# Altium project audiometr.PrjPcb
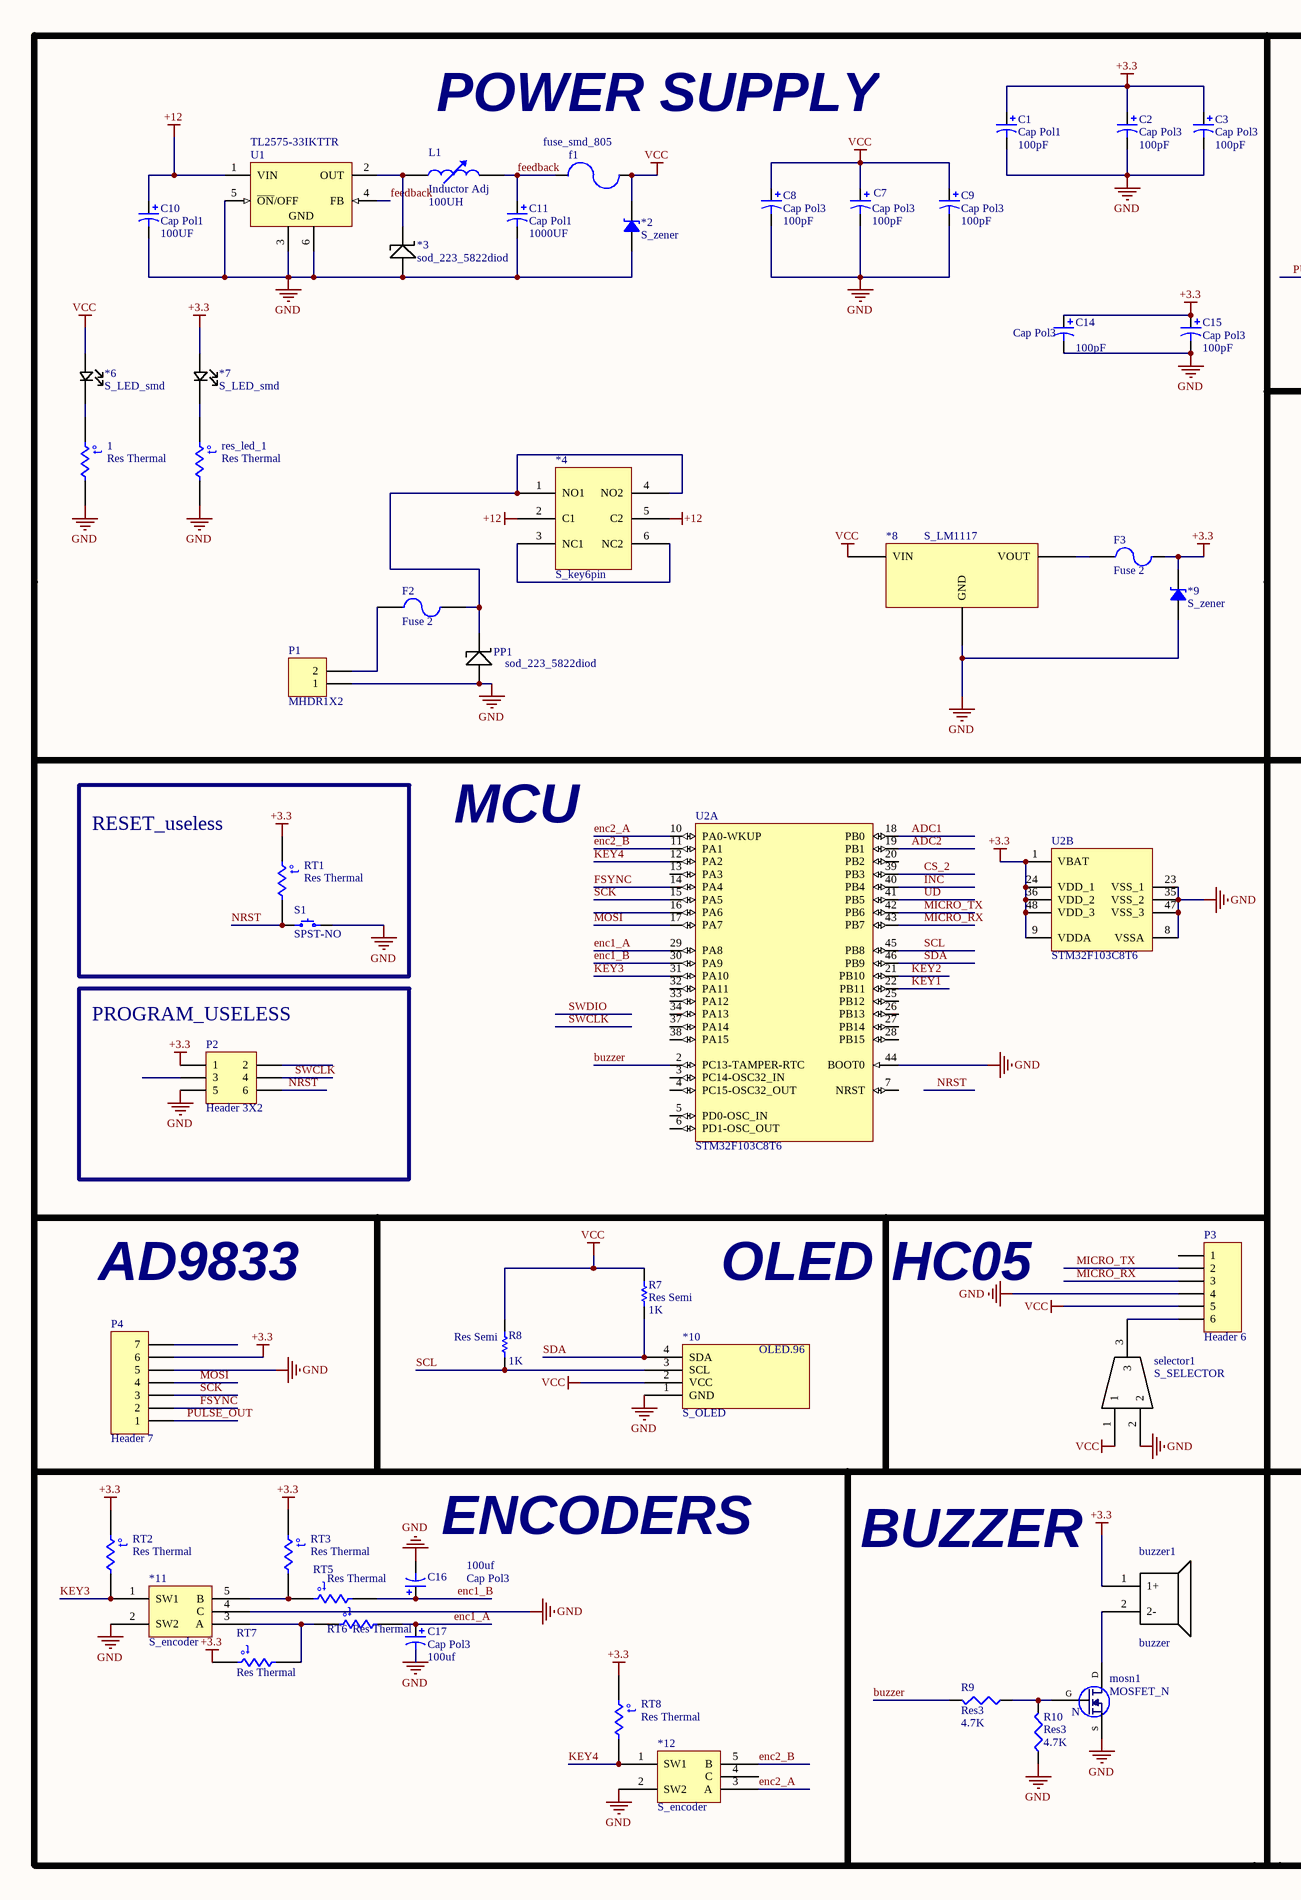
[diagram p0: audiometer.SchDoc, left]
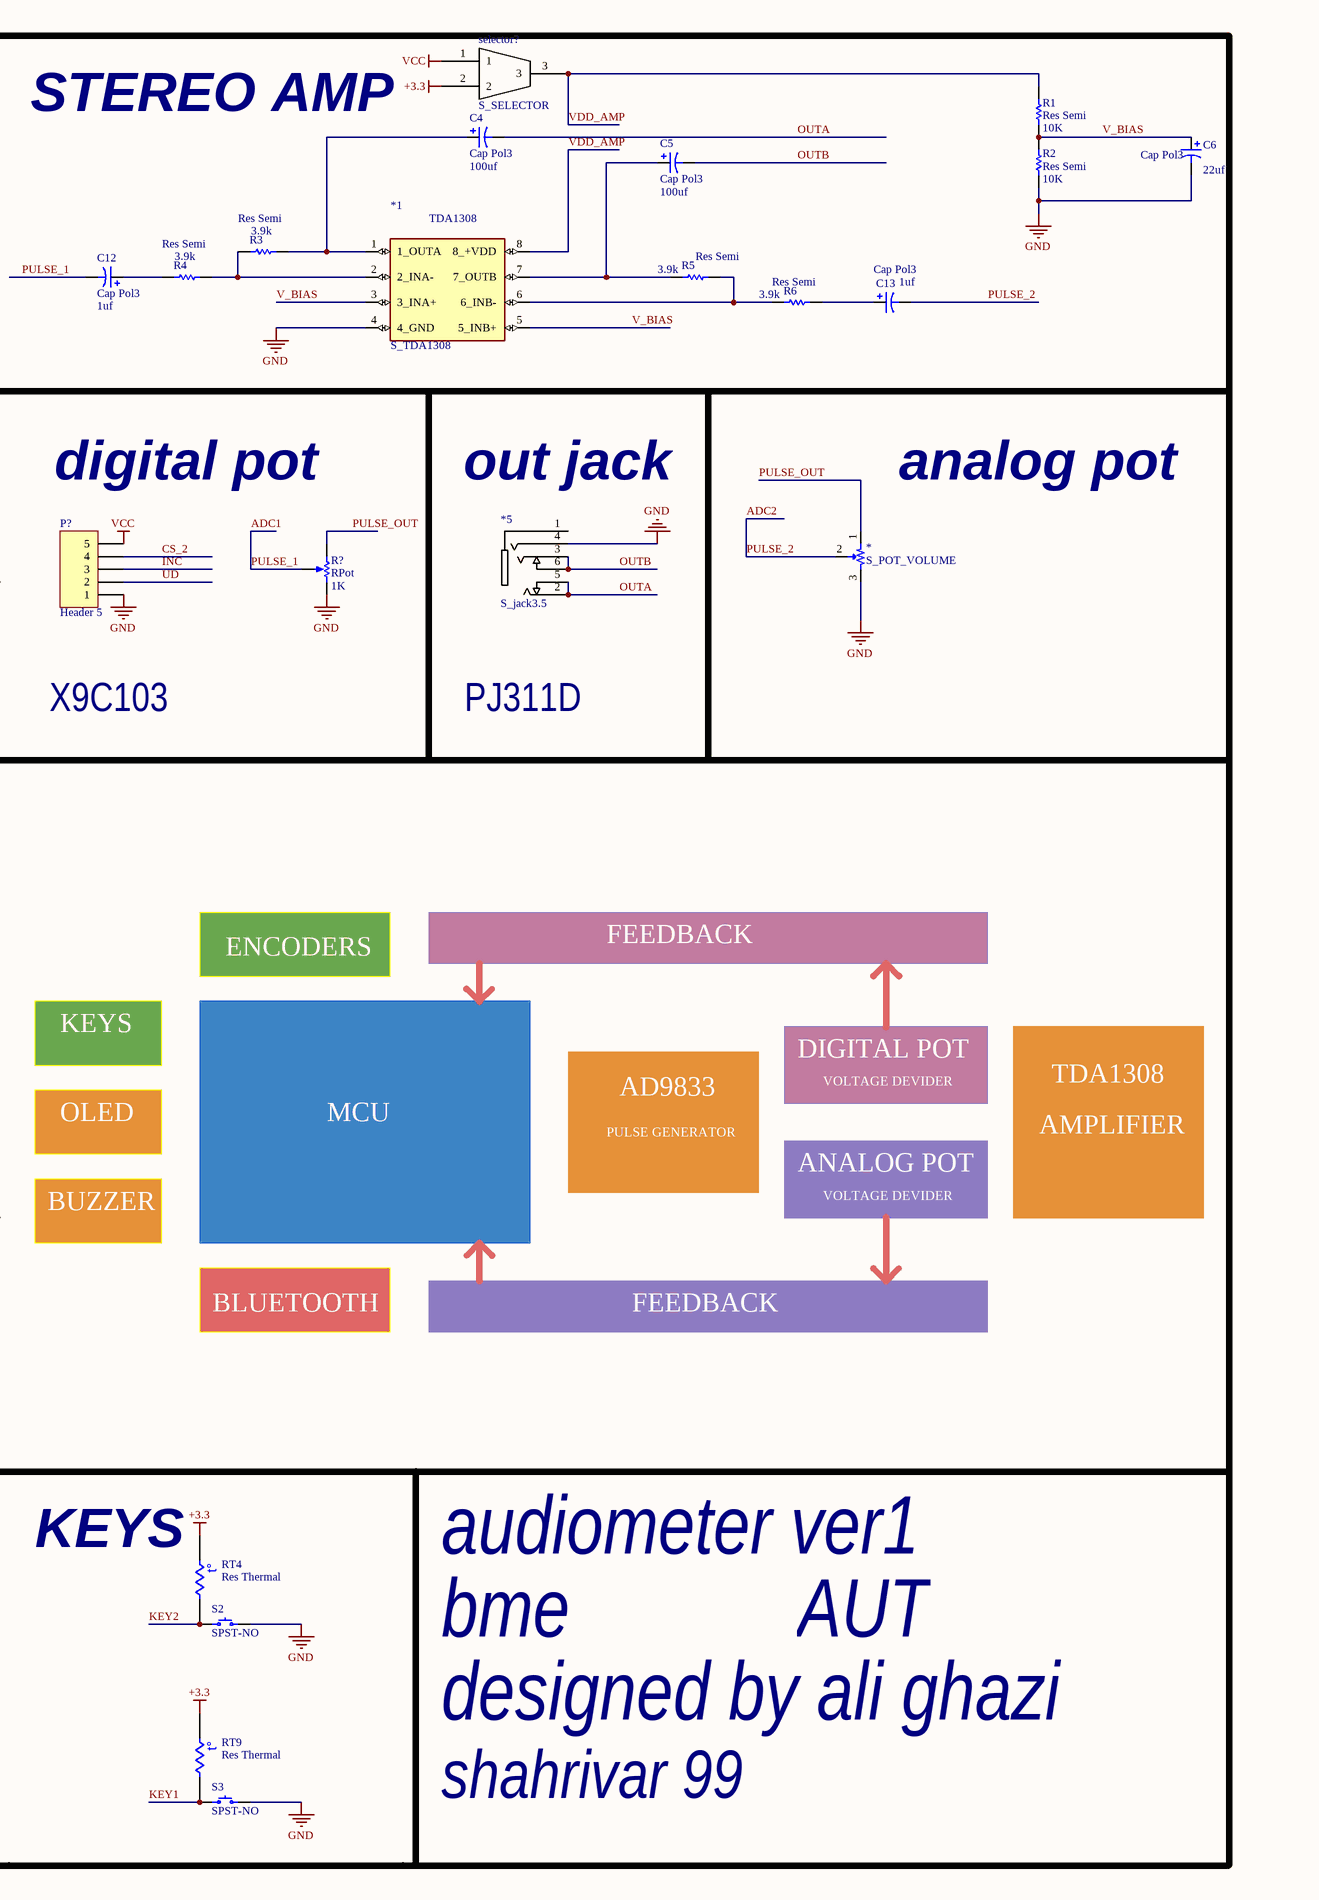
[diagram p1: audiometer.SchDoc, right]
1 sheet, 71 parts. Net scope: global (net labels, ports and power ports of the same name join across sheets).
Board file: audiometer.PcbDoc

## Sheet audiometer.SchDoc
size C

### Parts
1  Res Thermal  [6-0805_N]
*  S_POT_VOLUME  [F_POT_VOLUME]
*1  S_TDA1308  [F_TDA1308_so8]
*2  S_zener  [F_SMD_ZENR]
*3  sod_223_5822diod  [sod223-diod-5822]
*4  S_key6pin  [F_key6pin]
*5  S_jack3.5  [F_JACK3.5]
*6  S_LED_smd  [F_LED_805]
*7  S_LED_smd  [F_LED_805]
*8  S_LM1117  [F_LM1117]
*9  S_zener  [F_SMD_ZENR]
*10  S_OLED  [F_OLED]
*11  S_encoder  [F_encoder]
*12  S_encoder  [F_encoder]
buzzer1  buzzer  [buzzer]
C1  Cap Pol1  value 100pF  [cap2]
C2  Cap Pol3  value 100pF  [C0805]
C3  Cap Pol3  value 100pF  [C0805]
C4  Cap Pol3  value 100uf  [C0805]
C5  Cap Pol3  value 100uf  [C0805]
C6  Cap Pol3  value 22uf  [C0805]
C7  Cap Pol3  value 100pF  [C0805]
C8  Cap Pol3  value 100pF  [C0805]
C9  Cap Pol3  value 100pF  [C0805]
C10  Cap Pol1  value 100UF  [cap2]
C11  Cap Pol1  value 1000UF  [cap1]
C12  Cap Pol3  value 1uf  [C0805]
C13  Cap Pol3  value 1uf  [C0805]
C14  Cap Pol3  value 100pF  [C0805]
C15  Cap Pol3  value 100pF  [C0805]
C16  Cap Pol3  value 100uf  [C0805]
C17  Cap Pol3  value 100uf  [C0805]
f1  fuse_smd_805  [fuse_smd_805]
F2  Fuse 2  [PIN-W2/E2.8]
F3  Fuse 2  [PIN-W2/E2.8]
L1  Inductor Adj  value 100UH  [12_12_INDUCTOR_SMD]
mosn1  MOSFET_N  [mosfet_n_sot23a]
P1  MHDR1X2  [JST XH B2B-XH-A]
P2  Header 3X2  [HDR2X3]
P3  Header 6  [HDR1X6]
P4  Header 7  [HDR1X7]
P?  Header 5  [HDR1X5]
PP1  sod_223_5822diod  [sod223-diod-5822]
R1  Res Semi  value 10K  [AXIAL-0.5]
R2  Res Semi  value 10K  [AXIAL-0.5]
R3  Res Semi  value 3.9k  [AXIAL-0.5]
R4  Res Semi  value 3.9k  [AXIAL-0.5]
R5  Res Semi  value 3.9k  [AXIAL-0.5]
R6  Res Semi  value 3.9k  [AXIAL-0.5]
R7  Res Semi  value 1K  [AXIAL-0.5]
R8  Res Semi  value 1K  [AXIAL-0.5]
R9  Res3  value 4.7K  [C0805]
R10  Res3  value 4.7K  [C0805]
R?  RPot  value 1K  [VR5]
res_led_1  Res Thermal  [6-0805_N]
RT1  Res Thermal  [6-0805_N]
RT2  Res Thermal  [6-0805_N]
RT3  Res Thermal  [6-0805_N]
RT4  Res Thermal  [6-0805_N]
RT5  Res Thermal  [6-0805_N]
RT6  Res Thermal  [6-0805_N]
RT7  Res Thermal  [6-0805_N]
RT8  Res Thermal  [6-0805_N]
RT9  Res Thermal  [6-0805_N]
S1  SPST-NO  [TE FSMSMTR]
S2  SPST-NO  [TE FSMSMTR]
S3  SPST-NO  [TE FSMSMTR]
selector1  S_SELECTOR  [F_SELECTOR]
selector?  S_SELECTOR  [F_SELECTOR]
U1  TL2575-33IKTTR  [KTT5_N]
U2  STM32F103C8T6  [STM-LQFP48_N]  (parts A,B of 2)

### Blocks framed on the sheet
POWER SUPPLY: 1 *2-*4 *6-*9 C1-C3 C7-C11 C14 C15 f1 F2 F3 L1 P1 PP1 res_led_1 U1
RESET_useless: RT1 S1
PROGRAM_USELESS: P2

### Nets
+3.3: *7.2 *9.2 buzzer1.1(1+) C1.1 C2.1 C3.1 C14.1 C15.1 F3.2 P2.1 P4.6 RT1.1 RT2.1 RT3.1 RT4.1 RT7.1 RT8.1 RT9.1 selector?.2 U2.1(VBAT) U2.9(VDDA) U2.24(VDD_1) U2.36(VDD_2) U2.48(VDD_3)
+12: *4.2(C1) *4.5(C2) C10.1 U1.1(VIN)
GND: 1.2 *.3 *1.4(4_GND) *2.1 *3.1 *5.4(RING2) *8.1(GND) *9.1 *10.1(GND) *11.2(SW2) *11.4(C) *12.2(SW2) C1.2 C2.2 C3.2 C6.2 C7.2 C8.2 C9.2 C10.2 C11.2 C14.2 C15.2 C16.2 C17.2 mosn1.S P1.1 P2.5 P3.4 P4.5 P?.1 PP1.1 R2.1 R10.1 R?.2(BOT) res_led_1.2 S1.2 S2.2 S3.2 selector1.2 U1.3(GND) U1.5(~{ON}/OFF) U1.6(GND) U2.8(VSSA) U2.23(VSS_1) U2.35(VSS_2) U2.44(BOOT0) U2.47(VSS_3)
VCC: *2.2 *6.2 *8.3(VIN) *10.2(VCC) C7.1 C8.1 C9.1 f1.1 P3.5 P?.5 R7.2 R8.2 selector1.1 selector?.1
ADC1: C12.2 R?.3(TAP) U2.18(PB0)  [also labelled PULSE_1]
ADC2: *.2 C13.2 U2.19(PB1)  [also labelled PULSE_2]
buzzer: R9.2 U2.2(PC13-TAMPER-RTC)
CS_2: P?.4 U2.39(PB3)
enc1_A: C17.1 RT6.2 U2.29(PA8)
enc1_B: C16.1 RT5.2 U2.30(PA9)
enc2_A: *12.3(A) U2.10(PA0-WKUP)
enc2_B: *12.5(B) U2.11(PA1)
feedback: C11.1 f1.2 L1.2 U1.4(FB)
FSYNC: P4.2 U2.14(PA4)
INC: P?.3 U2.40(PB4)
KEY1: RT9.2 S3.1 U2.22(PB11)
KEY2: RT4.2 S2.1 U2.21(PB10)
KEY3: *11.1(SW1) RT2.2 U2.31(PA10)
KEY4: *12.1(SW1) RT8.2 U2.12(PA2)
MICRO_RX: P3.3 U2.43(PB7)
MICRO_TX: P3.2 U2.42(PB6)
MOSI: P4.4 U2.17(PA7)
NRST: P2.6 RT1.2 S1.1
OUTA: *5.2(TIP) *5.5(TIP_SWITCH) C4.2
OUTB: *5.3(RING1) *5.6(RING1_SWITCH) C5.2
PULSE_OUT: *.1 P4.1 R?.1(TOP)
SCK: P4.3 U2.15(PA5)
SCL: *10.3(SCL) R8.1 U2.45(PB8)
SDA: *10.4(SDA) R7.1 U2.46(PB9)
SWCLK: P2.4
UD: P?.2 U2.41(PB5)
V_BIAS: *1.3(3_INA+) *1.5(5_INB+) C6.1 R1.1 R2.2
VDD_AMP: *1.8(8_+VDD) R1.2 selector?.3
Net1_1: 1.1 *6.1
Net*1_1: *1.1(1_OUTA) C4.1 R3.2
Net*1_2: *1.2(2_INA-) R3.1 R4.2
Net*1_6: *1.6(6_INB-) R5.1 R6.2
Net*1_7: *1.7(7_OUTB) C5.1 R5.2
Net*3_2: *3.2 L1.1 U1.2(OUT)
Net*4_1: *4.1(NO1) *4.4(NO2) F2.2 PP1.2
Net*4_3: *4.3(NC1) *4.6(NC2)
Net*7_1: *7.1 res_led_1.1
Net*8_2: *8.2(VOUT) F3.1
Net*11_3: *11.3(A) RT6.1 RT7.2
Net*11_5: *11.5(B) RT3.2 RT5.1
Netbuzzer1_2: buzzer1.2(2-) mosn1.D
NetC12_1: C12.1 R4.1
NetC13_1: C13.1 R6.1
NetF2_1: F2.1 P1.2
Netmosn1_G: mosn1.G R9.1 R10.2
NetP3_6: P3.6 selector1.3

Not connected (* = marked no-connect by the designer): *5 1(SLEEVE); *12 4(C); P2 2 3; P3 1; P4 7; U2 3(PC14-OSC32_IN) 4(PC15-OSC32_OUT) 5(PD0-OSC_IN) 6(PD1-OSC_OUT) 7(NRST) 13(PA3) 16(PA6) 20(PB2) 25(PB12) 26(PB13) 27(PB14) 28(PB15) 32(PA11) 33(PA12) 34(PA13) 37(PA14) 38(PA15)

### Notes on the sheet
- STEREO AMP
- digital pot
- (near *5) out jack
- analog pot
- X9C103
- PJ311D
- MCU
- ENCODERS
- FEEDBACK
- KEYS
- AD9833
- DIGITAL POT
- VOLTAGE DEVIDER
- TDA1308
- OLED
- PULSE GENERATOR
- AMPLIFIER
- BUZZER
- ANALOG POT
- HC05
- BLUETOOTH
- (near C16) ENCODERS
- audiometer ver1
- bme
- AUT
- designed by ali ghazi
- shahrivar 99
- (in symbol MOSFET_N) N
- (in symbol Res Thermal) t°
- (in symbol S_OLED) OLED.96
- (in symbol S_TDA1308) TDA1308

### Library data of the parts
1 res_led_1 RT1-RT9 = Res Thermal: Thermistor; Published: 24-Mar-1999; LatestRevisionDate: 29-May-2009; LatestRevisionNote: IPC-7351 Footprint Added.; PackageVersion: Mar-2003; PackageReference: 6-0805; Publisher: Altium Limited; PackageDescription: Chip Resistor 0805 Case Size; Code_IPC: RESC2012
C1 C10 C11 = Cap Pol1: Polarized Capacitor (Radial); Published: 8-Jun-2000; LatestRevisionDate: 17-Jul-2002; LatestRevisionNote: Re-released for DXP Platform.; PackageReference: RB7.6-15; Publisher: Altium Limited; PackageDescription: Polarized Capacitor (Radial); 2 Leads
C2-C9 C12-C17 = Cap Pol3: Polarized Capacitor (Surface Mount); Published: 8-Jun-2000; LatestRevisionDate: 29-May-2009; LatestRevisionNote: IPC-7351 Footprint Added.; PackageReference: C0805; Publisher: Altium Limited; PackageDescription: Chip Capacitor
F2 F3 = Fuse 2: Fuse; Published: 8-Jun-2000; LatestRevisionDate: 17-Jul-2002; LatestRevisionNote: Re-released for DXP Platform.; PackageReference: PIN-W2/E2.8; Publisher: Altium Limited; PackageDescription: Thru-Hole; 2 Leads
L1 = Inductor Adj: Adjustable Inductor; Set Position: 0.5; Published: 24-Mar-1999; LatestRevisionDate: 17-Jul-2002; LatestRevisionNote: Re-released for DXP Platform.; PackageReference: AXIAL-0.8; Publisher: Altium Limited; PackageDescription: Axial Device, Thru-Hole; 2 Leads; 0.8 in Pin Spacing
P1 = MHDR1X2: Header, 2-Pin; LatestRevisionDate: 17-Jul-2002; LatestRevisionNote: Re-released for DXP Platform.; Publisher: Altium Limited
P2 = Header 3X2: Header, 3-Pin, Dual row; LatestRevisionDate: 17-Jul-2002; LatestRevisionNote: Re-released for DXP Platform.; Publisher: Altium Limited
P3 = Header 6: Header, 6-Pin; LatestRevisionDate: 17-Jul-2002; LatestRevisionNote: Re-released for DXP Platform.; Publisher: Altium Limited
P4 = Header 7: Header, 7-Pin; LatestRevisionDate: 17-Jul-2002; LatestRevisionNote: Re-released for DXP Platform.; Publisher: Altium Limited
P? = Header 5: Header, 5-Pin; LatestRevisionDate: 17-Jul-2002; LatestRevisionNote: Re-released for DXP Platform.; Publisher: Altium Limited
R1-R8 = Res Semi: Semiconductor Resistor; Published: 8-Jun-2000; LatestRevisionDate: 17-Jul-2002; LatestRevisionNote: Re-released for DXP Platform.; PackageReference: AXIAL-0.5; Publisher: Altium Limited; PackageDescription: Axial Device, Thru-Hole; 2 Leads; 0.5 in Pin Spacing
R9 R10 = Res3: Resistor; Published: 8-Jun-2000; LatestRevisionDate: 29-May-2009; LatestRevisionNote: IPC-7351 Footprint Added.; PackageReference: J1-0603; Publisher: Altium Limited; PackageDescription: Chip Resistor
R? = RPot: Potentiometer; Sim Note: Enter the Resistance value and the set point into parameter fields.; Set Position: 0.5; Published: 8-Jun-2000; LatestRevisionDate: 17-Jul-2002; LatestRevisionNote: Re-released for DXP Platform.; PackageReference: VR5; Publisher: Altium Limited; PackageDescription: Variable Resistor, Thru-Hole; 3 Leads
S1-S3 = SPST-NO 2 PIN
U1 = TL2575-33IKTTR: Buck Step Down Regulator with 4.75 to 40 V Input and 3.3 V Output, -40 to 125 degC, 5-Pin DDPAK/TO-263 (KTT), Green (RoHS & no Sb/Br); Manufacturer: Texas Instruments; Duty Cycle(Max)(%): 98; Iout(Max)(A): 1; Iq(Typ)(mA): 5; Preset Vout(V): 3.3; Rating: Catalog; SubFamily: Step-Down Regulator; Switch Current Limit(Typ)(A): 2.8; Vin(Max)(V): 40; Vin(Min)(V): 4.75; DatasheetVersion: SLVS638B; PackageVersion: revF, Jul-2011; PackageReference: KTT5; PackageDescription: 6-Pin Plastic Fange-Mount Package 1.7 mm Pitch, 15.2 mm Lead Span; Supplier 1: Digi-Key; Supplier Part Number 1: 296-21828-2-ND; Supplier 2: Digi-Key; Supplier Part Number 2: 296-21828-1-ND; Supplier 3: Digi-Key; Supplier Part Number 3: 296-21828-6-ND; Supplier 4: Farnell; Supplier Part Number 4: 1755280; Supplier 5: Newark; Supplier Part Number 5: 27M1032; Supplier 6: Mouser; Supplier Part Number 6: 595-TL2575-33IKTTR; Eco-Plan: Green (RoHS & no Sb/Br); Regulated Outputs(#): 1; Topology: Buck; Vout(Max)(V): 3.3; Vout(Min)(V): 3.3; Mounting Technology: Surface Mount; Code_JEDEC: TO-263-AB; PartNumber: TL2575-33IKTTR; ComponentLink1Description: Datasheet; ComponentLink1URL: http://www.ti.com/general/docs/lit/getliterature.tsp?genericPartNumber=TL2575-33&fileType=pdf; ComponentLink2Description: Package Specification; ComponentLink2URL: http://www.ti.com/litv/pdf/mpsf007e; ComponentLink3Description: URL Link1; ComponentLink3URL: Samples URL:http://www.ti.com/product/tl2575-33#samples
U2 = STM32F103C8T6: ARM Cortex-M3 32-bit MCU, 64 KB Flash, 20 KB Internal RAM, 37 I/Os, 48-pin LQFP, -40 to 85 degC, Tray; A/D Converter: 2x12-bit (10 Channel); FLASH Size (Prog) (kB): 64; I/Os (High Current): 37; Internal RAM Size (kB): 20; Operating Frequency(F) (Processor speed) (MHz): 72; Supply Voltage(Vcc) min (V): 2; DatasheetVersion: Rev. 16; PackageVersion: Rev. 6, 06/2013; PackageReference: LQFP48; PackageDescription: 48-Pin Low Profile Quad Flat Package, 7 x 7 mm Body, 0.5 mm Pitch; Supplier 1: Digi-Key; Supplier Part Number 1: 497-6063-ND; Supplier 2: Farnell; Supplier Part Number 2: 1447637; Supplier 3: Newark; Supplier Part Number 3: 59M2182; Supplier 4: Newark; Supplier Part Number 4: 57P1222; Supplier 5: Mouser; Supplier Part Number 5: 511-STM32F103C8T6; Core: ARM Cortex-M3; Packing: Tray; Mounting Technology: Surface Mount; PartNumber: STM32F103C8T6; ComponentLink1Description: Manufacturer URL; ComponentLink1URL: http://www.st.com/web/en/home.html; ComponentLink2Description: Datasheet; ComponentLink2URL: http://www.st.com/st-web-ui/static/active/en/resource/technical/document/datasheet/CD00161566.pdf; ComponentLink3Description: Package Specification; ComponentLink3URL: http://www.st.com/st-web-ui/static/active/en/resource/technical/document/datasheet/DM00058181.pdf